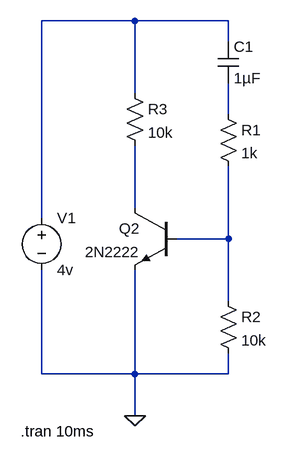
[diagram p0: schematic MFB.asc]
MFB.asc, the LTspice schematic file:
Version 4
SHEET 1 880 680
WIRE 336 -160 192 -160
WIRE 480 -160 336 -160
WIRE 480 -128 480 -160
WIRE 336 -48 336 -160
WIRE 480 -16 480 -64
WIRE 336 128 336 32
WIRE 192 144 192 -160
WIRE 480 176 480 64
WIRE 480 176 400 176
WIRE 480 272 480 176
WIRE 192 384 192 224
WIRE 336 384 336 224
WIRE 336 384 192 384
WIRE 480 384 480 352
WIRE 480 384 336 384
WIRE 336 448 336 384
FLAG 336 448 0
SYMBOL npn 400 128 M0
SYMATTR InstName Q2
SYMATTR Value 2N2222
SYMBOL res 464 -32 R0
SYMATTR InstName R1
SYMATTR Value 1k
SYMBOL res 464 256 R0
SYMATTR InstName R2
SYMATTR Value 10k
SYMBOL cap 464 -128 R0
SYMATTR InstName C1
SYMATTR Value 1µF
SYMBOL res 320 -64 R0
SYMATTR InstName R3
SYMATTR Value 10k
SYMBOL voltage 192 128 R0
WINDOW 123 0 0 Left 0
WINDOW 39 0 0 Left 0
SYMATTR InstName V1
SYMATTR Value 4v
TEXT 160 472 Left 2 !.tran 10ms

The netlist it stands for:
* MFB.asc
Q2 N003 N004 0 0 2N2222
R1 N002 N004 1k
R2 N004 0 10k
C1 N001 N002 1µF
R3 N001 N003 10k
V1 N001 0 4v
.model NPN NPN
.model PNP PNP
.lib standard.bjt
.tran 10ms
.backanno
.end